# Altium project VC099_V13_20211125.PrjPcb (part 2 of 2)

## Sheet 03.SchDoc
size 386 x 246 mm
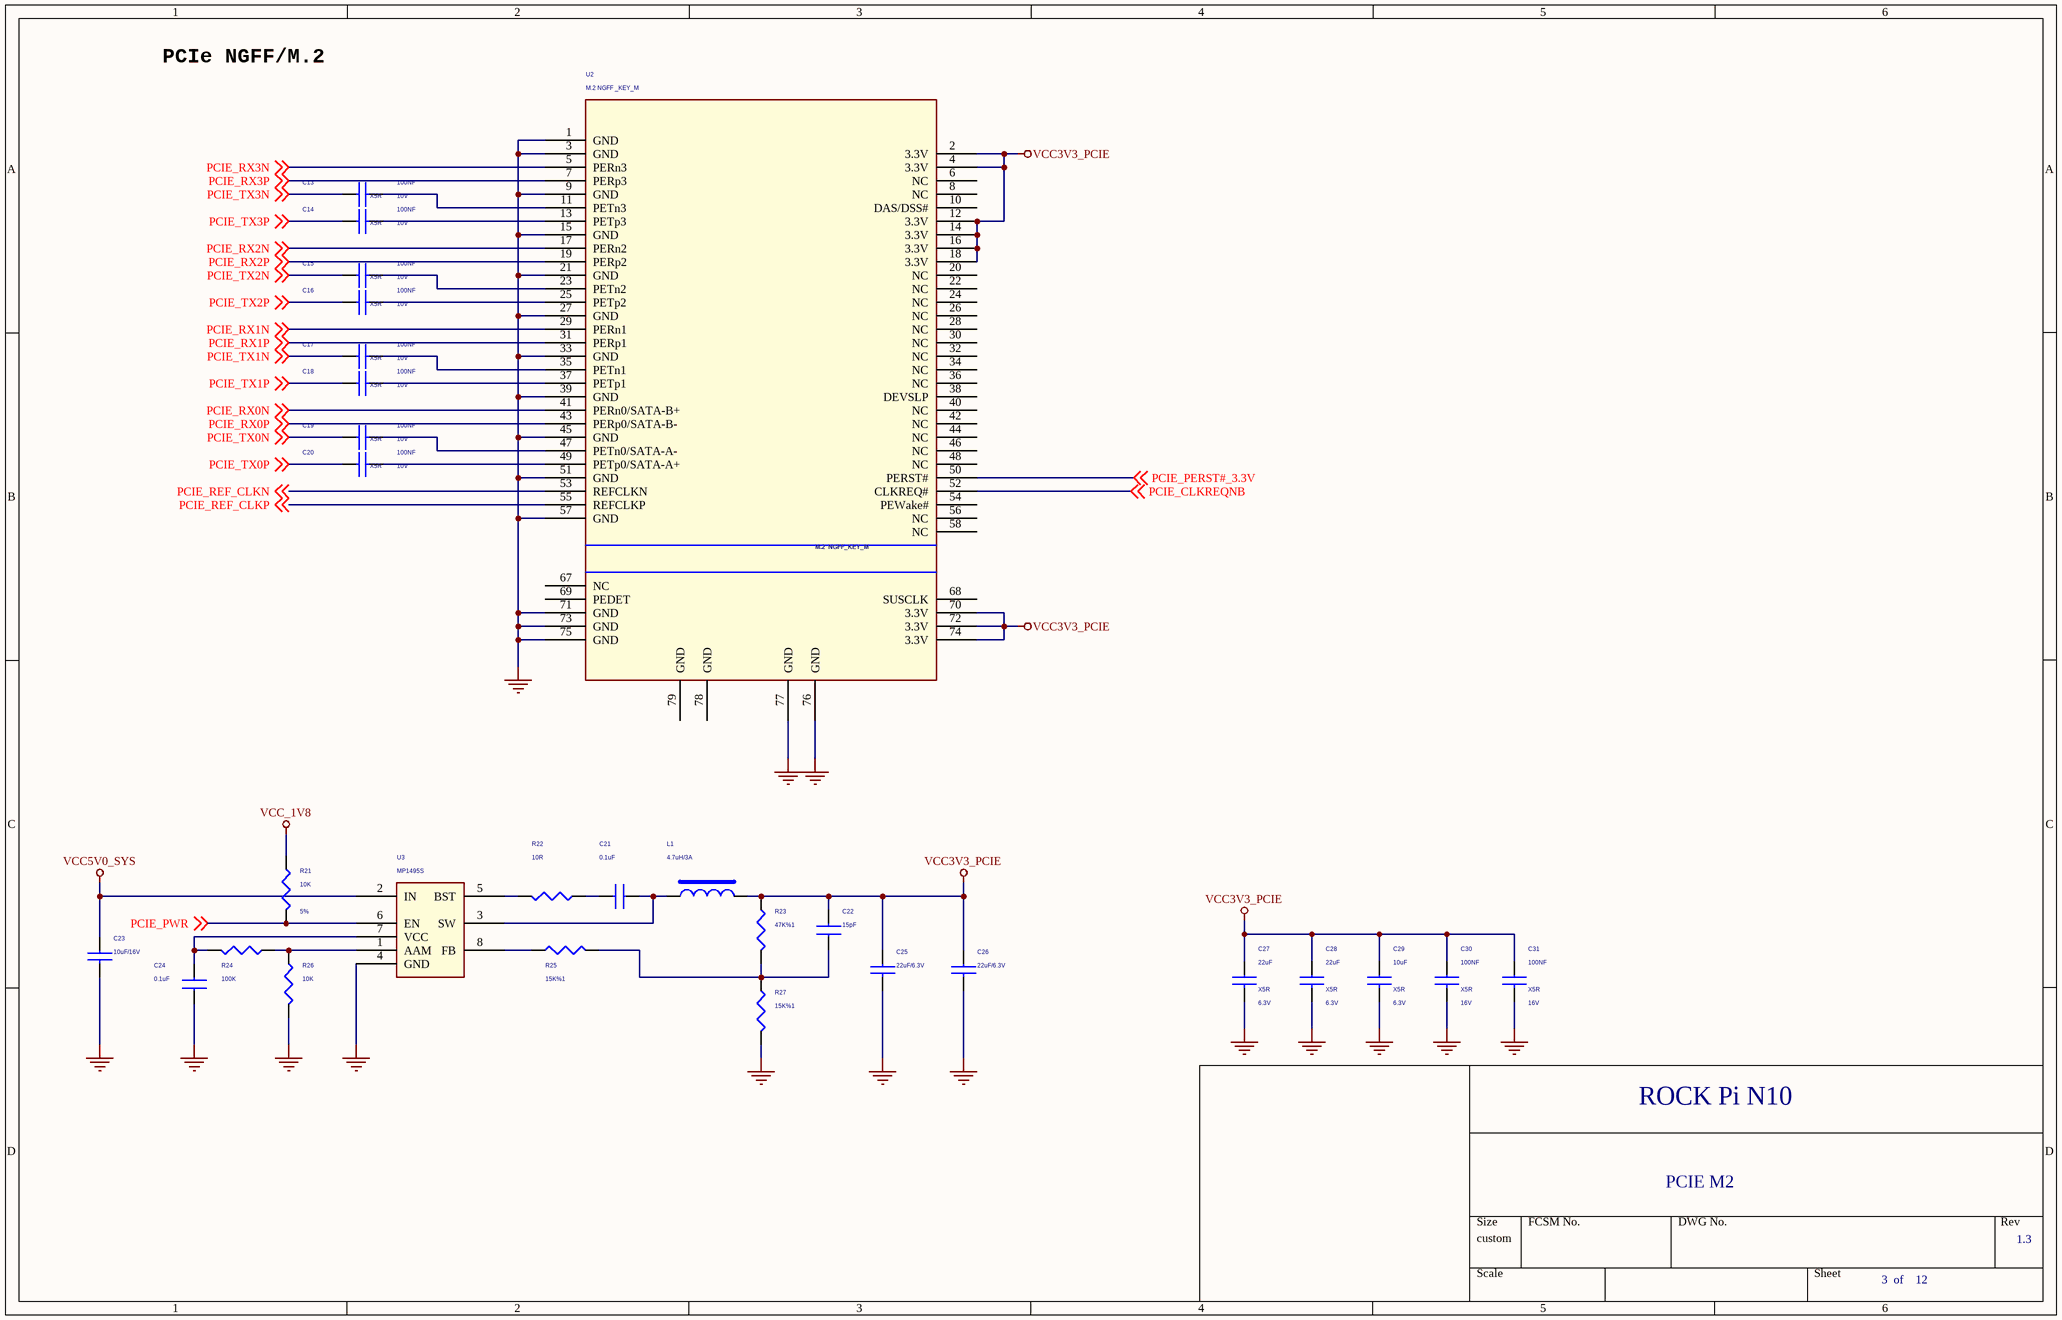
[diagram p9: 03.SchDoc]

### Parts
C13  100NF  Dielectric: X5R  Voltage: 10V  [C0201]
C14  100NF  Dielectric: X5R  Voltage: 10V  [C0201]
C15  100NF  Dielectric: X5R  Voltage: 10V  [C0201]
C16  100NF  Dielectric: X5R  Voltage: 10V  [C0201]
C17  100NF  Dielectric: X5R  Voltage: 10V  [C0201]
C18  100NF  Dielectric: X5R  Voltage: 10V  [C0201]
C19  100NF  Dielectric: X5R  Voltage: 10V  [C0201]
C20  100NF  Dielectric: X5R  Voltage: 10V  [C0201]
C21  0.1uF  [C0603]
C22  15pF  [C0603]
C23  10uF/16V  [C0805]
C24  0.1uF  [C0603]
C25  22uF/6.3V  [C0805]
C26  22uF/6.3V  [C0805]
C27  22uF  Dielectric: X5R  Voltage: 6.3V  [C0805]
C28  22uF  Dielectric: X5R  Voltage: 6.3V  [C0805]
C29  10uF  Dielectric: X5R  Voltage: 6.3V  [C0603]
C30  100NF  Dielectric: X5R  Voltage: 16V  [C0402]
C31  100NF  Dielectric: X5R  Voltage: 16V  [C0402]
L1  4.7uH/3A  [IND-6X6]
R21  10K  Tolerance: 5%  [R0402]
R22  10R  [R0402]
R23  47K%1  [R0402]
R24  100K  [R0402]
R25  15K%1  [R0402]
R26  10K  [R0402]
R27  15K%1  [R0402]
U2  M.2 NGFF _KEY_M  [M2_NGFF_KEY_M]
U3  MP1495S  [TSOT_23_8]

### Nets
GND: C23.2 C24.1 C25.2 C26.2 C27.2 C28.2 C29.2 C30.2 C31.2 R26.2 R27.2 U2.1(GND) U2.3(GND) U2.9(GND) U2.15(GND) U2.21(GND) U2.27(GND) U2.33(GND) U2.39(GND) U2.45(GND) U2.51(GND) U2.57(GND) U2.71(GND) U2.73(GND) U2.75(GND) U2.76(GND) U2.77(GND) U3.4(GND)
VCC3V3_PCIE: C22.2 C25.1 C26.1 C27.1 C28.1 C29.1 C30.1 C31.1 L1.2 R23.1 U2.2(3.3V) U2.4(3.3V) U2.12(3.3V) U2.14(3.3V) U2.16(3.3V) U2.18(3.3V) U2.70(3.3V) U2.72(3.3V) U2.74(3.3V)
VCC5V0_SYS: C23.1 U3.2(IN)
VCC_1V8: R21.1
PCIE_CLKREQNB: U2.52(CLKREQ#) ; off-sheet PCIE_CLKREQNB
PCIE_PERST#_3.3V: U2.50(PERST#) ; off-sheet PCIE_PERST#_3.3V
PCIE_PWR: R21.2 U3.6(EN) ; off-sheet PCIE_PWR
PCIE_REF_CLKN: U2.53(REFCLKN) ; off-sheet PCIE_REF_CLKN
PCIE_REF_CLKP: U2.55(REFCLKP) ; off-sheet PCIE_REF_CLKP
PCIE_RX0N: U2.41(PERn0/SATA-B+) ; off-sheet PCIE_RX0N
PCIE_RX0P: U2.43(PERp0/SATA-B-) ; off-sheet PCIE_RX0P
PCIE_RX1N: U2.29(PERn1) ; off-sheet PCIE_RX1N
PCIE_RX1P: U2.31(PERp1) ; off-sheet PCIE_RX1P
PCIE_RX2N: U2.17(PERn2) ; off-sheet PCIE_RX2N
PCIE_RX2P: U2.19(PERp2) ; off-sheet PCIE_RX2P
PCIE_RX3N: U2.5(PERn3) ; off-sheet PCIE_RX3N
PCIE_RX3P: U2.7(PERp3) ; off-sheet PCIE_RX3P
PCIE_TX0N: C19.1 ; off-sheet PCIE_TX0N
PCIE_TX0P: C20.1 ; off-sheet PCIE_TX0P
PCIE_TX1N: C17.1 ; off-sheet PCIE_TX1N
PCIE_TX1P: C18.1 ; off-sheet PCIE_TX1P
PCIE_TX2N: C15.1 ; off-sheet PCIE_TX2N
PCIE_TX2P: C16.1 ; off-sheet PCIE_TX2P
PCIE_TX3N: C13.1 ; off-sheet PCIE_TX3N
PCIE_TX3P: C14.1 ; off-sheet PCIE_TX3P
NetC13_2: C13.2 U2.11(PETn3)
NetC14_2: C14.2 U2.13(PETp3)
NetC15_2: C15.2 U2.23(PETn2)
NetC16_2: C16.2 U2.25(PETp2)
NetC17_2: C17.2 U2.35(PETn1)
NetC18_2: C18.2 U2.37(PETp1)
NetC19_2: C19.2 U2.47(PETn0/SATA-A-)
NetC20_2: C20.2 U2.49(PETp0/SATA-A+)
NetC21_1: C21.1 L1.1 U3.3(SW)
NetC21_2: C21.2 R22.1
NetC22_1: C22.1 R23.2 R25.2 R27.1
NetC24_2: C24.2 R24.2 U3.7(VCC)
NetR22_2: R22.2 U3.5(BST)
NetR24_1: R24.1 R26.1 U3.1(AAM)
NetR25_1: R25.1 U3.8(FB)

Not connected (* = marked no-connect by the designer): U2 6(NC) 8(NC) 10(DAS/DSS#) 20(NC) 22(NC) 24(NC) 26(NC) 28(NC) 30(NC) 32(NC) 34(NC) 36(NC) 38(DEVSLP) 40(NC) 42(NC) 44(NC) 46(NC) 48(NC) 54(PEWake#) 56(NC) 58(NC) 67(NC) 68(SUSCLK) 69(PEDET) 78(GND) 79(GND)

### Notes on the sheet
- PCIe NGFF/M.2
- ROCK Pi N10
- PCIE M2
- 1.3
- 3  of    12
- (in symbol M_5.2 NGFF EKEY SOCKET) M.2  NGFF_KEY_M

### Library data of the parts
C13-C18 = CAP NP_2: cap,100.00nF,+/-10%,10V,X5R,C0201; Manufacturer PN: C0603X5R1A104K030BC; Manufacturer: TDK; Tolerance: 10%; Priority: A; Created by: JJJ; Part Type: C0201; RK PN: C0603X5R1A104K030BC
C19 C20 = CAP NP_2: cap,100.00nF,+/-10%,10V,X5R,C0201; Manufacturer: TDK; RK PN: C0603X5R1A104K030BC; Priority: A; Tolerance: 10%; Part Type: C0201; Manufacturer PN: C0603X5R1A104K030BC; Created by: JJJ
C21 C22 C24 = CAP NP_Dup3: RoHS CHIP CAP 1uF +10/-10% 16V X5R
C23 C25 C26 = CAP NP_2_Dup1: ROOM: CHG
C27 C28 = CAP NP_2: cap,22.00uF,+/-20%,6.3V,X5R,C0603; Manufacturer PN: C1608X5R0J226M080AC; Manufacturer: TDK; Tolerance: 20%; Priority: A; Created by: JJJ; Part Type: C0603; RK PN: C1608X5R0J226M080AC
C29 = CAP NP_2: cap,10.00uF,+/-10%,6.3V,X5R,C0603; Manufacturer PN: C1608X5R0J106K080AB; Manufacturer: TDK; Tolerance: 10%; Priority: A; Created by: JJJ; Part Type: C0603; RK PN: C1608X5R0J106K080AB
C30 = CAP NP_2: as C108 on sheet 12; Part Type: C0402; Manufacturer PN: C1005X5R1C104K050BA; Created by: JJJ
C31 = CAP NP_2: as C107 on sheet 12; Created by: JJJ; Part Type: C0402; RK PN: C1005X5R1C104K050BA
L1 = INDUCTORS OF FERRITE_Dup1
R21 = RESISTOR_3: as R89 on sheet 11; Created by: YTL; Part Type: 通用厚膜电阻; RK PN: RC0402JR-0710KL
R22-R27 = RESISTOR_0: RES,thick film,47KOhm,+/-5%,1/16W,SMD0402; MARK: 51K
U2 = M_5.2 NGFF EKEY SOCKET
U3 = BUCK-MP1495

## Sheet 02.SchDoc
size 297 x 209 mm
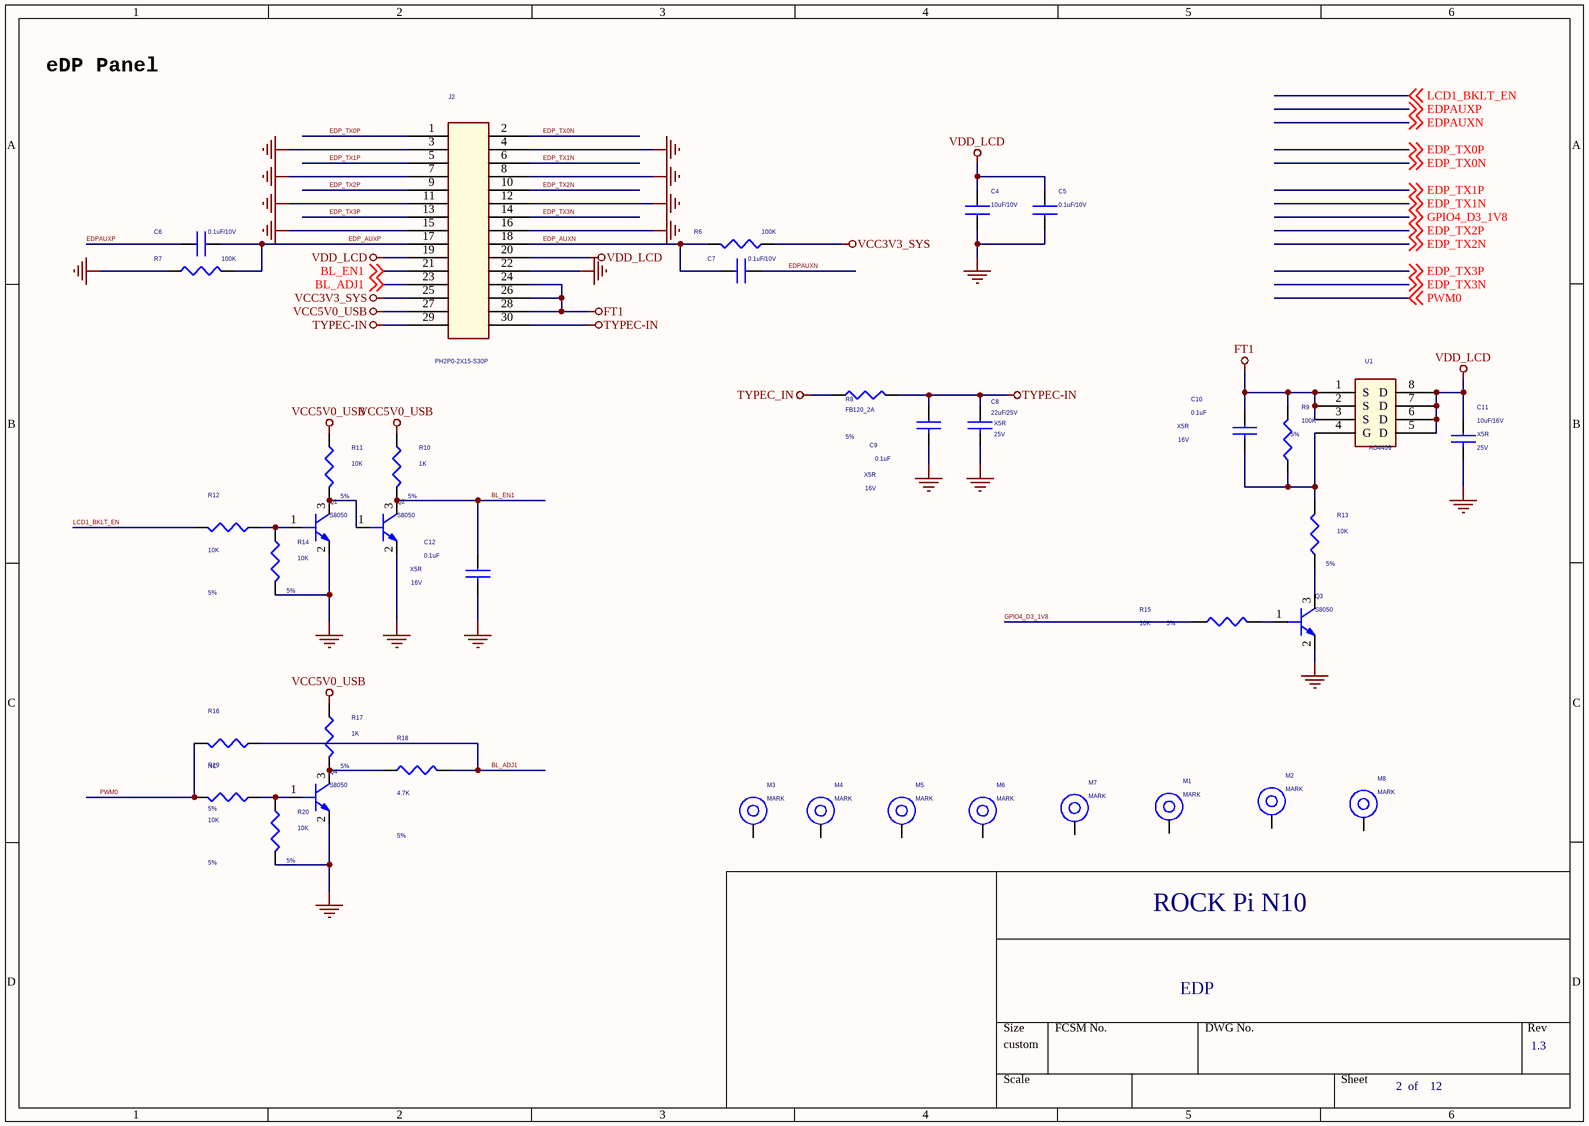
[diagram p10: 02.SchDoc]

### Parts
C4  10uF/10V  [C0603]
C5  0.1uF/10V  [C0603]
C6  0.1uF/10V  [C0603]
C7  0.1uF/10V  [C0603]
C8  22uF/25V  Dielectric: X5R  Voltage: 25V  [C0805]
C9  0.1uF  Dielectric: X5R  Voltage: 16V  [C0402]
C10  0.1uF  Dielectric: X5R  Voltage: 16V  [C0402]
C11  10uF/16V  Dielectric: X5R  Voltage: 25V  [C0805]
C12  0.1uF  Dielectric: X5R  Voltage: 16V  [C0402]
J2  PH2P0-2X15-S30P  [PH2P0-2X15-S30P]
M1  MARK  [MARK]
M2  MARK  [MARK]
M3  MARK  [MARK]
M4  MARK  [MARK]
M5  MARK  [MARK]
M6  MARK  [MARK]
M7  MARK  [MARK]
M8  MARK  [MARK]
Q1  S8050  [SOT_23]
Q2  S8050  [SOT_23]
Q3  S8050  [SOT23]
Q4  S8050  [SOT_23]
R6  100K  [R0402]
R7  100K  [R0402]
R8  FB120_2A  Tolerance: 5%  [R0402]
R9  100K  Tolerance: 5%  [R0402]
R10  1K  Tolerance: 5%  [R0402]
R11  10K  Tolerance: 5%  [R0402]
R12  10K  Tolerance: 5%  [R0402]
R13  10K  Tolerance: 5%  [R0402]
R14  10K  Tolerance: 5%  [R0402]
R15  10K  Tolerance: 5%  [R0402]
R16  NC  Tolerance: 5%  [R0402]
R17  1K  Tolerance: 5%  [R0402]
R18  4.7K  Tolerance: 5%  [R0402]
R19  10K  Tolerance: 5%  [R0402]
R20  10K  Tolerance: 5%  [R0402]
U1  AO4409  [SOP8-50-150]

### Nets
FT1: C10.1 J2.24 J2.26 J2.28 R9.1 U1.1(S) U1.2(S) U1.3(S)
GND: C4.2 C5.2 C8.2 C9.2 C11.2 C12.2 J2.3 J2.4 J2.7 J2.8 J2.11 J2.12 J2.15 J2.16 J2.22 Q1.2(EMITTER) Q2.2(EMITTER) Q3.2(EMITTER) Q4.2(EMITTER) R7.2 R14.1 R20.1
TYPEC-IN: C8.1 C9.1 J2.29 J2.30 R8.2
TYPEC_IN: R8.1
VCC3V3_SYS: J2.25 R6.2
VCC5V0_USB: J2.27 R10.2 R11.2 R17.2
VDD_LCD: C4.1 C5.1 C11.1 J2.19 J2.20 U1.5(D) U1.6(D) U1.7(D) U1.8(D)
BL_ADJ1: J2.23 R16.2 R18.1 ; off-sheet BL_ADJ1
BL_EN1: C12.1 J2.21 Q2.3(COLLECTOR) R10.1 ; off-sheet BL_EN1
EDP_AUXN: C7.2 J2.18 R6.1
EDP_AUXP: C6.2 J2.17 R7.1
EDP_TX0N: J2.2 ; off-sheet EDP_TX0N
EDP_TX0P: J2.1 ; off-sheet EDP_TX0P
EDP_TX1N: J2.6 ; off-sheet EDP_TX1N
EDP_TX1P: J2.5 ; off-sheet EDP_TX1P
EDP_TX2N: J2.10 ; off-sheet EDP_TX2N
EDP_TX2P: J2.9 ; off-sheet EDP_TX2P
EDP_TX3N: J2.14 ; off-sheet EDP_TX3N
EDP_TX3P: J2.13 ; off-sheet EDP_TX3P
EDPAUXN: C7.1 ; off-sheet EDPAUXN
EDPAUXP: C6.1 ; off-sheet EDPAUXP
GPIO4_D3_1V8: R15.1 ; off-sheet GPIO4_D3_1V8
LCD1_BKLT_EN: R12.1 ; off-sheet LCD1_BKLT_EN
PWM0: R16.1 R19.1 ; off-sheet PWM0
NetC10_2: C10.2 R9.2 R13.1 U1.4(G)
NetQ1_1: Q1.1(BASE) R12.2 R14.2
NetQ1_3: Q1.3(COLLECTOR) Q2.1(BASE) R11.1
NetQ3_1: Q3.1(BASE) R15.2
NetQ3_3: Q3.3(COLLECTOR) R13.2
NetQ4_1: Q4.1(BASE) R19.2 R20.2
NetQ4_3: Q4.3(COLLECTOR) R17.1 R18.2

Not connected (* = marked no-connect by the designer): M1 1; M2 1; M3 1; M4 1; M5 1; M6 1; M7 1; M8 1

### Notes on the sheet
- eDP Panel
- ROCK Pi N10
- EDP
- 1.3
- 2  of    12

### Library data of the parts
C4 = CAP NP_Dup4: CAP,MLCC,4.7uF,+/-10%,X5R,6.3V,SMD0603
C5-C7 = CAP NP_Dup4: CAP,MLCC,100nF,+/-10%,X7R,6.3V,SMD0402
C8 = CAP NP_2: cap,4.70uF,+/-10%,6.3V,X5R,C0603; Manufacturer PN: C1608X5R0J475K080AB; Manufacturer: TDK; Tolerance: 10%; Priority: A; Created by: JJJ; Part Type: C0603; RK PN: C1608X5R0J475K080AB
C9 C12 = CAP NP_2: cap,100.00nF,+/-10%,6.3V,X5R,C0402; Manufacturer PN: C1005X5R0J104K050BA; Manufacturer: TDK; Tolerance: 10%; Priority: A; Created by: JJJ; Part Type: C0402; RK PN: C1005X5R0J104K050BA
C10 = CAP NP_2: cap,100.00nF,+/-10%,6.3V,X5R,C0402; Manufacturer: TDK; RK PN: C1005X5R0J104K050BA; Priority: A; Tolerance: 10%; Part Type: C0402; Manufacturer PN: C1005X5R0J104K050BA; Created by: JJJ
C11 = CAP NP_2: cap,4.70uF,+/-10%,6.3V,X5R,C0603; Manufacturer: TDK; RK PN: C1608X5R0J475K080AB; Priority: A; Tolerance: 10%; Part Type: C0603; Manufacturer PN: C1608X5R0J475K080AB; Created by: JJJ
J2 = CON20A_2
M1 M2 M4-M8 = MARK: MARK Symble; RK PN: MARK01; Priority: A; Part Type: MARK; Created by: CZD
M3 = MARK: MARK Symble; Priority: A; RK PN: MARK01; Created by: CZD; Part Type: MARK
Q1 Q2 = NPN: S8050 SOT23; Manufacturer: 长电; Manufacturer PN: S8050_SOT23; Priority: A; Ic: 0.5A; Vceo: 25V; Pc: 0.3W; RK PN: S8050; Part Type: NPN; Created by: JJJ
Q3 Q4 = NPN: S8050 SOT23; Manufacturer PN: S8050_SOT23; Manufacturer: 长电; Pc: 0.3W; Vceo: 25V; Ic: 0.5A; Priority: A; Created by: JJJ; Part Type: NPN; RK PN: S8050
R6 R7 = RESISTOR_1_Dup1
R8 R10 R13 R19 R20 = RESISTOR_3: as R89 on sheet 11; Created by: YTL; RK PN: RC0402JR-0710KL
  R8: Part Type: R0603
  R10 R13 R19 R20: Part Type: 通用厚膜电阻
R9 = RESISTOR_3: 通用厚膜电阻,100K,+/-5%,R0402,1/16W.; Manufacturer: YAGEO; RK PN: RC0402JR-07100KL; Priority: A; Wattage: 1/16W; Part Type: 通用厚膜电阻; Manufacturer PN: RC0402JR-07100KL; Created by: YTL
R11 R12 R14-R18 = RESISTOR_3: 通用厚膜电阻,10K,+/-5%,R0402,1/16W.; Manufacturer: YAGEO; RK PN: RC0402JR-0710KL; Priority: A; Wattage: 1/16W; Part Type: 通用厚膜电阻; Manufacturer PN: RC0402JR-0710KL; Created by: YTL
U1 = AO4409_0

## Sheet 01.SchDoc
size 420 x 496 mm
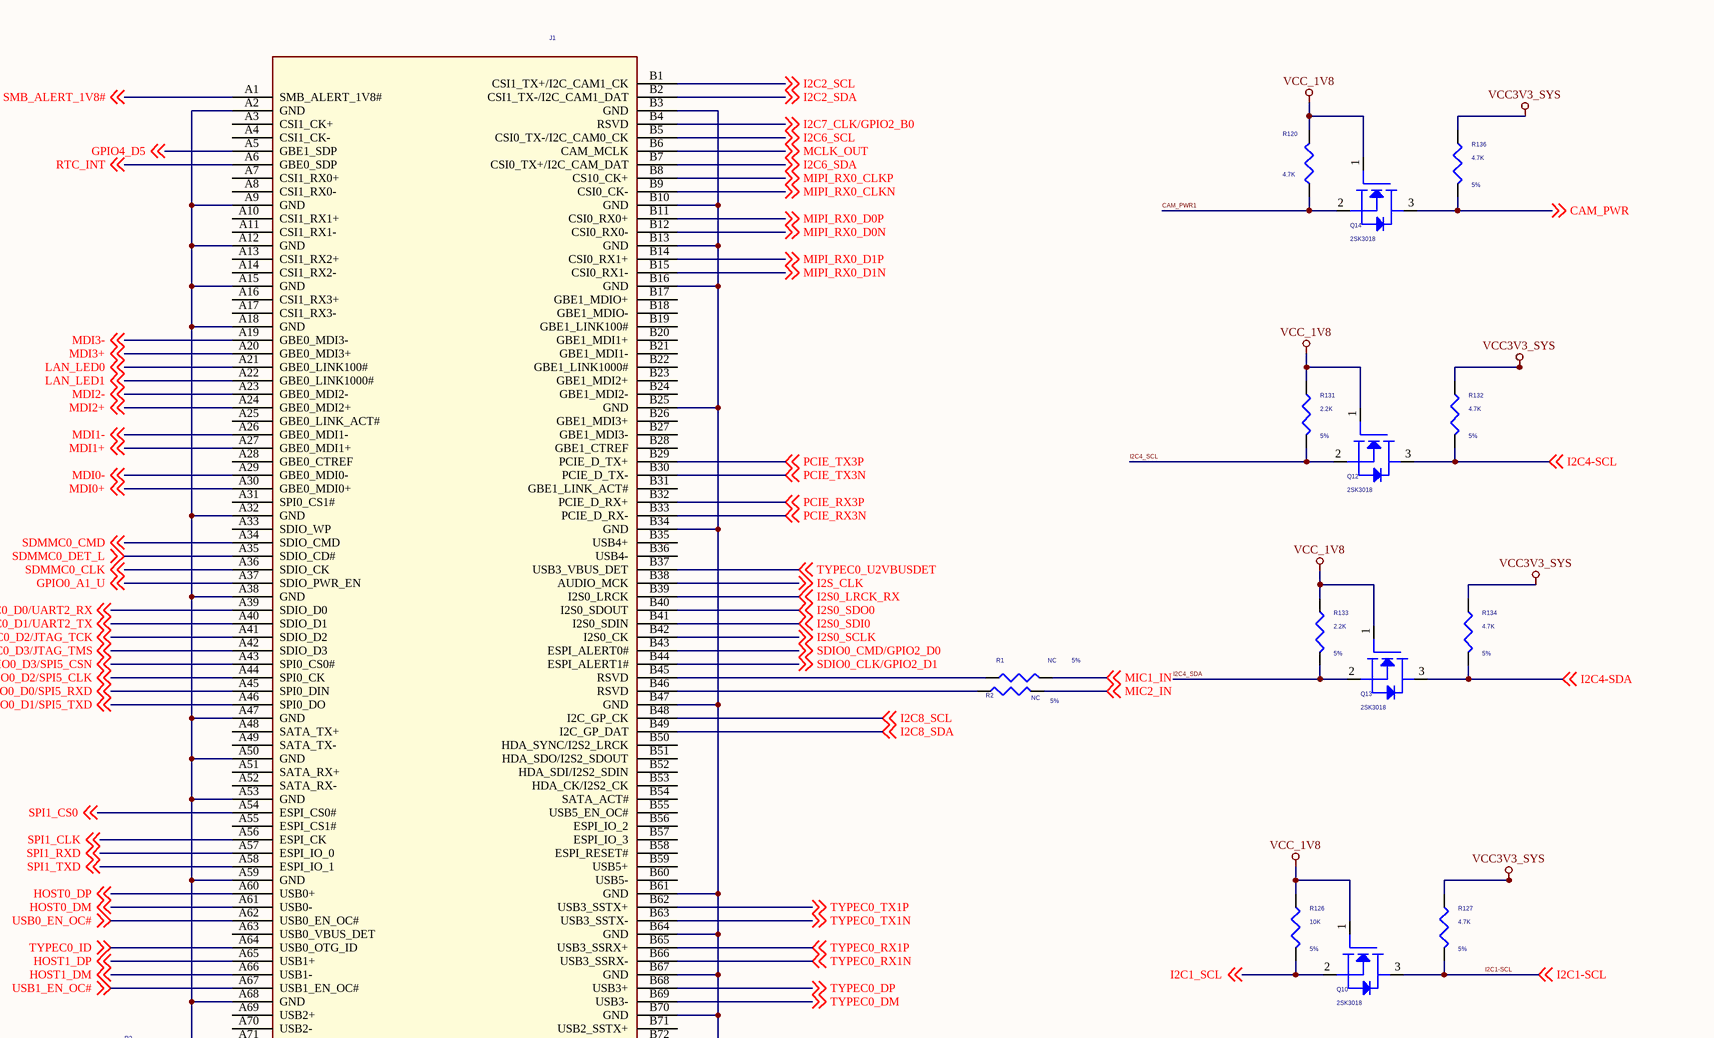
[diagram p11: 01.SchDoc, top]
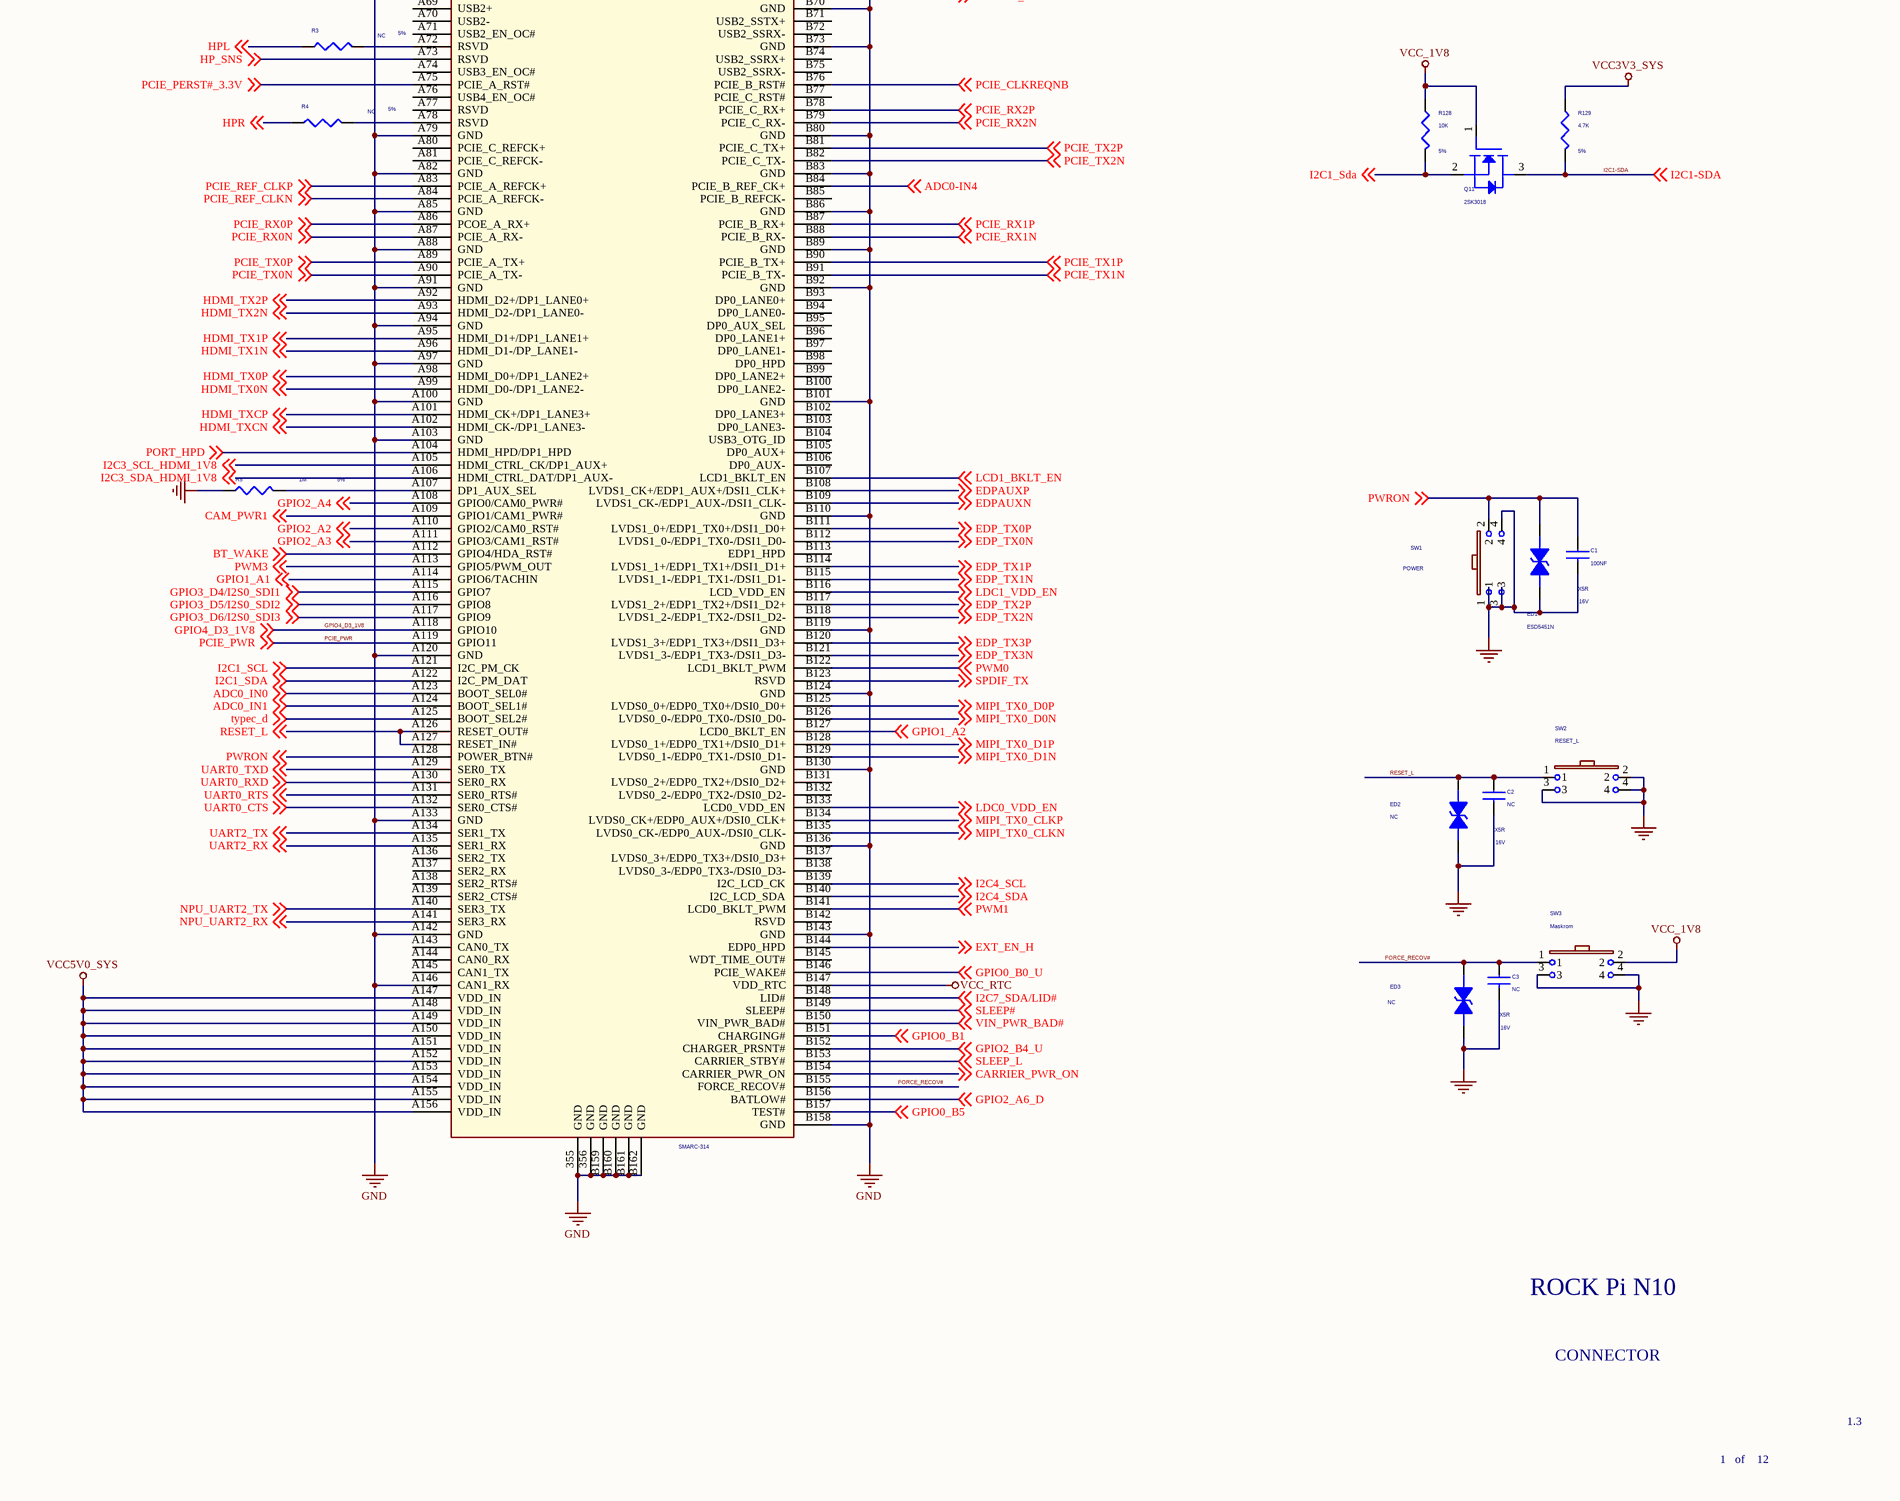
[diagram p12: 01.SchDoc, bottom]

### Parts
C1  100NF  Dielectric: X5R  Voltage: 16V  [C0402]
C2  NC  Dielectric: X5R  Voltage: 16V  [C0402]
C3  NC  Dielectric: X5R  Voltage: 16V  [C0402]
ED1  ESD5451N  [ESD0402]
ED2  NC  [ESD0402]
ED3  NC  [ESD0402]
J1  SMARC-314  [SMARC-314C]
Q10  2SK3018  [SOT23]
Q11  2SK3018  [SOT23]
Q12  2SK3018  [SOT23]
Q13  2SK3018  [SOT23]
Q14  2SK3018  [SOT23]
R1  NC  Tolerance: 5%  [R0402]
R2  NC  Tolerance: 5%  [R0402]
R3  NC  Tolerance: 5%  [R0402]
R4  NC  Tolerance: 5%  [R0402]
R5  1M  Tolerance: 5%  [R0402]
R120  4.7K  [R0402]
R126  10K  Tolerance: 5%  [R0402]
R127  4.7K  Tolerance: 5%  [R0402]
R128  10K  Tolerance: 5%  [R0402]
R129  4.7K  Tolerance: 5%  [R0402]
R131  2.2K  Tolerance: 5%  [R0402]
R132  4.7K  Tolerance: 5%  [R0402]
R133  2.2K  Tolerance: 5%  [R0402]
R134  4.7K  Tolerance: 5%  [R0402]
R136  4.7K  Tolerance: 5%  [R0402]
SW1  POWER  [YC-6615B]
SW2  RESET_L  [YC-6615B]
SW3  Maskrom  [YC-6615B]

### Nets
GND: C1.2 C2.2 C3.2 ED1.2 ED2.2 ED3.2 J1.355(GND) J1.356(GND) J1.A2(GND) J1.A9(GND) J1.A12(GND) J1.A15(GND) J1.A18(GND) J1.A32(GND) J1.A38(GND) J1.A47(GND) J1.A50(GND) J1.A53(GND) J1.A59(GND) J1.A68(GND) J1.A79(GND) J1.A82(GND) J1.A85(GND) J1.A88(GND) J1.A91(GND) J1.A94(GND) J1.A97(GND) J1.A100(GND) J1.A103(GND) J1.A120(GND) J1.A133(GND) J1.A142(GND) J1.A146(CAN1_RX) J1.B3(GND) J1.B10(GND) J1.B13(GND) J1.B16(GND) J1.B25(GND) J1.B34(GND) J1.B47(GND) J1.B61(GND) J1.B64(GND) J1.B67(GND) J1.B70(GND) J1.B73(GND) J1.B80(GND) J1.B83(GND) J1.B86(GND) J1.B89(GND) J1.B92(GND) J1.B101(GND) J1.B110(GND) J1.B119(GND) J1.B124(GND) J1.B130(GND) J1.B136(GND) J1.B143(GND) J1.B158(GND) J1.B159(GND) J1.B160(GND) J1.B161(GND) J1.B162(GND) R5.1 SW1.1 SW1.3 SW1.4 SW2.2 SW2.3 SW2.4 SW3.3 SW3.4
VCC3V3_SYS: R127.1 R129.1 R132.1 R134.1 R136.1
VCC5V0_SYS: J1.A147(VDD_IN) J1.A148(VDD_IN) J1.A149(VDD_IN) J1.A150(VDD_IN) J1.A151(VDD_IN) J1.A152(VDD_IN) J1.A153(VDD_IN) J1.A154(VDD_IN) J1.A155(VDD_IN) J1.A156(VDD_IN)
VCC_1V8: Q10.1(GATE) Q11.1(GATE) Q12.1(GATE) Q13.1(GATE) Q14.1(GATE) R120.2 R126.1 R128.1 R131.1 R133.1 SW3.2
VCC_RTC: J1.B147(VDD_RTC)
ADC0-IN4: J1.B84(PCIE_B_REF_CK+) ; off-sheet ADC0-IN4
ADC0_IN0: J1.A123(BOOT_SEL0#) ; off-sheet ADC0_IN0
ADC0_IN1: J1.A124(BOOT_SEL1#) ; off-sheet ADC0_IN1
BT_WAKE: J1.A112(GPIO4/HDA_RST#) ; off-sheet BT_WAKE
CAM_PWR: Q14.3(DRAIN) R136.2 ; off-sheet CAM_PWR
CAM_PWR1: J1.A109(GPIO1/CAM1_PWR#) Q14.2(SOURCE) R120.1 ; off-sheet CAM_PWR1
CARRIER_PWR_ON: J1.B154(CARRIER_PWR_ON) ; off-sheet CARRIER_PWR_ON
EDP_TX0N: J1.B112(LVDS1_0-/EDP1_TX0-/DSI1_D0-) ; off-sheet EDP_TX0N
EDP_TX0P: J1.B111(LVDS1_0+/EDP1_TX0+/DSI1_D0+) ; off-sheet EDP_TX0P
EDP_TX1N: J1.B115(LVDS1_1-/EDP1_TX1-/DSI1_D1-) ; off-sheet EDP_TX1N
EDP_TX1P: J1.B114(LVDS1_1+/EDP1_TX1+/DSI1_D1+) ; off-sheet EDP_TX1P
EDP_TX2N: J1.B118(LVDS1_2-/EDP1_TX2-/DSI1_D2-) ; off-sheet EDP_TX2N
EDP_TX2P: J1.B117(LVDS1_2+/EDP1_TX2+/DSI1_D2+) ; off-sheet EDP_TX2P
EDP_TX3N: J1.B121(LVDS1_3-/EDP1_TX3-/DSI1_D3-) ; off-sheet EDP_TX3N
EDP_TX3P: J1.B120(LVDS1_3+/EDP1_TX3+/DSI1_D3+) ; off-sheet EDP_TX3P
EDPAUXN: J1.B109(LVDS1_CK-/EDP1_AUX-/DSI1_CLK-) ; off-sheet EDPAUXN
EDPAUXP: J1.B108(LVDS1_CK+/EDP1_AUX+/DSI1_CLK+) ; off-sheet EDPAUXP
EXT_EN_H: J1.B144(EDP0_HPD) ; off-sheet EXT_EN_H
FORCE_RECOV#: C3.1 ED3.1 J1.B155(FORCE_RECOV#) SW3.1
GPIO0_A1_U: J1.A37(SDIO_PWR_EN) ; off-sheet GPIO0_A1_U
GPIO0_B0_U: J1.B146(PCIE_WAKE#) ; off-sheet GPIO0_B0_U
GPIO0_B1: J1.B151(CHARGING#) ; off-sheet GPIO0_B1
GPIO0_B5: J1.B157(TEST#) ; off-sheet GPIO0_B5
GPIO1_A1: J1.A114(GPIO6/TACHIN) ; off-sheet GPIO1_A1
GPIO1_A2: J1.B127(LCD0_BKLT_EN) ; off-sheet GPIO1_A2
GPIO2_A2: J1.A110(GPIO2/CAM0_RST#) ; off-sheet GPIO2_A2
GPIO2_A3: J1.A111(GPIO3/CAM1_RST#) ; off-sheet GPIO2_A3
GPIO2_A4: J1.A108(GPIO0/CAM0_PWR#) ; off-sheet GPIO2_A4
GPIO2_A6_D: J1.B156(BATLOW#) ; off-sheet GPIO2_A6_D
GPIO2_B4_U: J1.B152(CHARGER_PRSNT#) ; off-sheet GPIO2_B4_U
GPIO3_D4/I2S0_SDI1: J1.A115(GPIO7) ; off-sheet GPIO3_D4/I2S0_SDI1
GPIO3_D5/I2S0_SDI2: J1.A116(GPIO8) ; off-sheet GPIO3_D5/I2S0_SDI2
GPIO3_D6/I2S0_SDI3: J1.A117(GPIO9) ; off-sheet GPIO3_D6/I2S0_SDI3
GPIO4_D3_1V8: J1.A118(GPIO10) ; off-sheet GPIO4_D3_1V8
GPIO4_D5: J1.A5(GBE1_SDP) ; off-sheet GPIO4_D5
HDMI_TX0N: J1.A99(HDMI_D0-/DP1_LANE2-) ; off-sheet HDMI_TX0N
HDMI_TX0P: J1.A98(HDMI_D0+/DP1_LANE2+) ; off-sheet HDMI_TX0P
HDMI_TX1N: J1.A96(HDMI_D1-/DP_LANE1-) ; off-sheet HDMI_TX1N
HDMI_TX1P: J1.A95(HDMI_D1+/DP1_LANE1+) ; off-sheet HDMI_TX1P
HDMI_TX2N: J1.A93(HDMI_D2-/DP1_LANE0-) ; off-sheet HDMI_TX2N
HDMI_TX2P: J1.A92(HDMI_D2+/DP1_LANE0+) ; off-sheet HDMI_TX2P
HDMI_TXCN: J1.A102(HDMI_CK-/DP1_LANE3-) ; off-sheet HDMI_TXCN
HDMI_TXCP: J1.A101(HDMI_CK+/DP1_LANE3+) ; off-sheet HDMI_TXCP
HOST0_DM: J1.A61(USB0-) ; off-sheet HOST0_DM
HOST0_DP: J1.A60(USB0+) ; off-sheet HOST0_DP
HOST1_DM: J1.A66(USB1-) ; off-sheet HOST1_DM
HOST1_DP: J1.A65(USB1+) ; off-sheet HOST1_DP
HP_SNS: J1.A73(RSVD) ; off-sheet HP_SNS
HPL: R3.1 ; off-sheet HPL
HPR: R4.1 ; off-sheet HPR
I2C1-SCL: Q10.3(DRAIN) R127.2 ; off-sheet I2C1-SCL
I2C1-SDA: Q11.3(DRAIN) R129.2 ; off-sheet I2C1-SDA
I2C1_SCL: J1.A121(I2C_PM_CK) Q10.2(SOURCE) R126.2 ; off-sheet I2C1_SCL
I2C1_SDA: J1.A122(I2C_PM_DAT) Q11.2(SOURCE) R128.2 ; off-sheet I2C1_SDA, off-sheet I2C1_Sda
I2C2_SCL: J1.B1(CSI1_TX+/I2C_CAM1_CK) ; off-sheet I2C2_SCL
I2C2_SDA: J1.B2(CSI1_TX-/I2C_CAM1_DAT) ; off-sheet I2C2_SDA
I2C3_SCL_HDMI_1V8: J1.A105(HDMI_CTRL_CK/DP1_AUX+) ; off-sheet I2C3_SCL_HDMI_1V8
I2C3_SDA_HDMI_1V8: J1.A106(HDMI_CTRL_DAT/DP1_AUX-) ; off-sheet I2C3_SDA_HDMI_1V8
I2C4-SCL: Q12.3(DRAIN) R132.2 ; off-sheet I2C4-SCL
I2C4-SDA: Q13.3(DRAIN) R134.2 ; off-sheet I2C4-SDA
I2C4_SCL: J1.B139(I2C_LCD_CK) Q12.2(SOURCE) R131.2 ; off-sheet I2C4_SCL
I2C4_SDA: J1.B140(I2C_LCD_SDA) Q13.2(SOURCE) R133.2 ; off-sheet I2C4_SDA
I2C6_SCL: J1.B5(CSI0_TX-/I2C_CAM0_CK) ; off-sheet I2C6_SCL
I2C6_SDA: J1.B7(CSI0_TX+/I2C_CAM_DAT) ; off-sheet I2C6_SDA
I2C7_CLK/GPIO2_B0: J1.B4(RSVD) ; off-sheet I2C7_CLK/GPIO2_B0
I2C7_SDA/LID#: J1.B148(LID#) ; off-sheet I2C7_SDA/LID#
I2C8_SCL: J1.B48(I2C_GP_CK) ; off-sheet I2C8_SCL
I2C8_SDA: J1.B49(I2C_GP_DAT) ; off-sheet I2C8_SDA
I2S0_LRCK_RX: J1.B39(I2S0_LRCK) ; off-sheet I2S0_LRCK_RX
I2S0_SCLK: J1.B42(I2S0_CK) ; off-sheet I2S0_SCLK
I2S0_SDI0: J1.B41(I2S0_SDIN) ; off-sheet I2S0_SDI0
I2S0_SDO0: J1.B40(I2S0_SDOUT) ; off-sheet I2S0_SDO0
I2S_CLK: J1.B38(AUDIO_MCK) ; off-sheet I2S_CLK
LAN_LED0: J1.A21(GBE0_LINK100#) ; off-sheet LAN_LED0
LAN_LED1: J1.A22(GBE0_LINK1000#) ; off-sheet LAN_LED1
LCD1_BKLT_EN: J1.B107(LCD1_BKLT_EN) ; off-sheet LCD1_BKLT_EN
LDC0_VDD_EN: J1.B133(LCD0_VDD_EN) ; off-sheet LDC0_VDD_EN
LDC1_VDD_EN: J1.B116(LCD_VDD_EN) ; off-sheet LDC1_VDD_EN
MCLK_OUT: J1.B6(CAM_MCLK) ; off-sheet MCLK_OUT
MDI0+: J1.A30(GBE0_MDI0+) ; off-sheet MDI0+
MDI0-: J1.A29(GBE0_MDI0-) ; off-sheet MDI0-
MDI1+: J1.A27(GBE0_MDI1+) ; off-sheet MDI1+
MDI1-: J1.A26(GBE0_MDI1-) ; off-sheet MDI1-
MDI2+: J1.A24(GBE0_MDI2+) ; off-sheet MDI2+
MDI2-: J1.A23(GBE0_MDI2-) ; off-sheet MDI2-
MDI3+: J1.A20(GBE0_MDI3+) ; off-sheet MDI3+
MDI3-: J1.A19(GBE0_MDI3-) ; off-sheet MDI3-
MIC1_IN: R1.2 ; off-sheet MIC1_IN
MIC2_IN: R2.2 ; off-sheet MIC2_IN
MIPI_RX0_CLKN: J1.B9(CSI0_CK-) ; off-sheet MIPI_RX0_CLKN
MIPI_RX0_CLKP: J1.B8(CS10_CK+) ; off-sheet MIPI_RX0_CLKP
MIPI_RX0_D0N: J1.B12(CSI0_RX0-) ; off-sheet MIPI_RX0_D0N
MIPI_RX0_D0P: J1.B11(CSI0_RX0+) ; off-sheet MIPI_RX0_D0P
MIPI_RX0_D1N: J1.B15(CSI0_RX1-) ; off-sheet MIPI_RX0_D1N
MIPI_RX0_D1P: J1.B14(CSI0_RX1+) ; off-sheet MIPI_RX0_D1P
MIPI_TX0_CLKN: J1.B135(LVDS0_CK-/EDP0_AUX-/DSI0_CLK-) ; off-sheet MIPI_TX0_CLKN
MIPI_TX0_CLKP: J1.B134(LVDS0_CK+/EDP0_AUX+/DSI0_CLK+) ; off-sheet MIPI_TX0_CLKP
MIPI_TX0_D0N: J1.B126(LVDS0_0-/EDP0_TX0-/DSI0_D0-) ; off-sheet MIPI_TX0_D0N
MIPI_TX0_D0P: J1.B125(LVDS0_0+/EDP0_TX0+/DSI0_D0+) ; off-sheet MIPI_TX0_D0P
MIPI_TX0_D1N: J1.B129(LVDS0_1-/EDP0_TX1-/DSI0_D1-) ; off-sheet MIPI_TX0_D1N
MIPI_TX0_D1P: J1.B128(LVDS0_1+/EDP0_TX1+/DSI0_D1+) ; off-sheet MIPI_TX0_D1P
NPU_UART2_RX: J1.A141(SER3_RX) ; off-sheet NPU_UART2_RX
NPU_UART2_TX: J1.A140(SER3_TX) ; off-sheet NPU_UART2_TX
PCIE_CLKREQNB: J1.B76(PCIE_B_RST#) ; off-sheet PCIE_CLKREQNB
PCIE_PERST#_3.3V: J1.A75(PCIE_A_RST#) ; off-sheet PCIE_PERST#_3.3V
PCIE_PWR: J1.A119(GPIO11) ; off-sheet PCIE_PWR
PCIE_REF_CLKN: J1.A84(PCIE_A_REFCK-) ; off-sheet PCIE_REF_CLKN
PCIE_REF_CLKP: J1.A83(PCIE_A_REFCK+) ; off-sheet PCIE_REF_CLKP
PCIE_RX0N: J1.A87(PCIE_A_RX-) ; off-sheet PCIE_RX0N
PCIE_RX0P: J1.A86(PCOE_A_RX+) ; off-sheet PCIE_RX0P
PCIE_RX1N: J1.B88(PCIE_B_RX-) ; off-sheet PCIE_RX1N
PCIE_RX1P: J1.B87(PCIE_B_RX+) ; off-sheet PCIE_RX1P
PCIE_RX2N: J1.B79(PCIE_C_RX-) ; off-sheet PCIE_RX2N
PCIE_RX2P: J1.B78(PCIE_C_RX+) ; off-sheet PCIE_RX2P
PCIE_RX3N: J1.B33(PCIE_D_RX-) ; off-sheet PCIE_RX3N
PCIE_RX3P: J1.B32(PCIE_D_RX+) ; off-sheet PCIE_RX3P
PCIE_TX0N: J1.A90(PCIE_A_TX-) ; off-sheet PCIE_TX0N
PCIE_TX0P: J1.A89(PCIE_A_TX+) ; off-sheet PCIE_TX0P
PCIE_TX1N: J1.B91(PCIE_B_TX-) ; off-sheet PCIE_TX1N
PCIE_TX1P: J1.B90(PCIE_B_TX+) ; off-sheet PCIE_TX1P
PCIE_TX2N: J1.B82(PCIE_C_TX-) ; off-sheet PCIE_TX2N
PCIE_TX2P: J1.B81(PCIE_C_TX+) ; off-sheet PCIE_TX2P
PCIE_TX3N: J1.B30(PCIE_D_TX-) ; off-sheet PCIE_TX3N
PCIE_TX3P: J1.B29(PCIE_D_TX+) ; off-sheet PCIE_TX3P
PORT_HPD: J1.A104(HDMI_HPD/DP1_HPD) ; off-sheet PORT_HPD
PWM0: J1.B122(LCD1_BKLT_PWM) ; off-sheet PWM0
PWM1: J1.B141(LCD0_BKLT_PWM) ; off-sheet PWM1
PWM3: J1.A113(GPIO5/PWM_OUT) ; off-sheet PWM3
PWRON: C1.1 ED1.1 J1.A128(POWER_BTN#) SW1.2 ; off-sheet PWRON
RESET_L: C2.1 ED2.1 J1.A126(RESET_OUT#) J1.A127(RESET_IN#) SW2.1 ; off-sheet RESET_L
RTC_INT: J1.A6(GBE0_SDP) ; off-sheet RTC_INT
SDIO0_CLK/GPIO2_D1: J1.B44(ESPI_ALERT1#) ; off-sheet SDIO0_CLK/GPIO2_D1
SDIO0_CMD/GPIO2_D0: J1.B43(ESPI_ALERT0#) ; off-sheet SDIO0_CMD/GPIO2_D0
SDIO0_D0/SPI5_RXD: J1.A45(SPI0_DIN) ; off-sheet SDIO0_D0/SPI5_RXD
SDIO0_D1/SPI5_TXD: J1.A46(SPI0_DO) ; off-sheet SDIO0_D1/SPI5_TXD
SDIO0_D2/SPI5_CLK: J1.A44(SPI0_CK) ; off-sheet SDIO0_D2/SPI5_CLK
SDIO0_D3/SPI5_CSN: J1.A43(SPI0_CS0#) ; off-sheet SDIO0_D3/SPI5_CSN
SDMMC0_CLK: J1.A36(SDIO_CK) ; off-sheet SDMMC0_CLK
SDMMC0_CMD: J1.A34(SDIO_CMD) ; off-sheet SDMMC0_CMD
SDMMC0_D0/UART2_RX: J1.A39(SDIO_D0) ; off-sheet SDMMC0_D0/UART2_RX
SDMMC0_D1/UART2_TX: J1.A40(SDIO_D1) ; off-sheet SDMMC0_D1/UART2_TX
SDMMC0_D2/JTAG_TCK: J1.A41(SDIO_D2) ; off-sheet SDMMC0_D2/JTAG_TCK
SDMMC0_D3/JTAG_TMS: J1.A42(SDIO_D3) ; off-sheet SDMMC0_D3/JTAG_TMS
SDMMC0_DET_L: J1.A35(SDIO_CD#) ; off-sheet SDMMC0_DET_L
SLEEP#: J1.B149(SLEEP#) ; off-sheet SLEEP#
SLEEP_L: J1.B153(CARRIER_STBY#) ; off-sheet SLEEP_L
SMB_ALERT_1V8#: J1.A1(SMB_ALERT_1V8#) ; off-sheet SMB_ALERT_1V8#
SPDIF_TX: J1.B123(RSVD) ; off-sheet SPDIF_TX
SPI1_CLK: J1.A56(ESPI_CK) ; off-sheet SPI1_CLK
SPI1_CS0: J1.A54(ESPI_CS0#) ; off-sheet SPI1_CS0
SPI1_RXD: J1.A57(ESPI_IO_0) ; off-sheet SPI1_RXD
SPI1_TXD: J1.A58(ESPI_IO_1) ; off-sheet SPI1_TXD
TYPEC0_DM: J1.B69(USB3-) ; off-sheet TYPEC0_DM
TYPEC0_DP: J1.B68(USB3+) ; off-sheet TYPEC0_DP
TYPEC0_ID: J1.A64(USB0_OTG_ID) ; off-sheet TYPEC0_ID
TYPEC0_RX1N: J1.B66(USB3_SSRX-) ; off-sheet TYPEC0_RX1N
TYPEC0_RX1P: J1.B65(USB3_SSRX+) ; off-sheet TYPEC0_RX1P
TYPEC0_TX1N: J1.B63(USB3_SSTX-) ; off-sheet TYPEC0_TX1N
TYPEC0_TX1P: J1.B62(USB3_SSTX+) ; off-sheet TYPEC0_TX1P
TYPEC0_U2VBUSDET: J1.B37(USB3_VBUS_DET) ; off-sheet TYPEC0_U2VBUSDET
TYPEC_D: J1.A125(BOOT_SEL2#) ; off-sheet typec_d
UART0_CTS: J1.A132(SER0_CTS#) ; off-sheet UART0_CTS
UART0_RTS: J1.A131(SER0_RTS#) ; off-sheet UART0_RTS
UART0_RXD: J1.A130(SER0_RX) ; off-sheet UART0_RXD
UART0_TXD: J1.A129(SER0_TX) ; off-sheet UART0_TXD
UART2_RX: J1.A135(SER1_RX) ; off-sheet UART2_RX
UART2_TX: J1.A134(SER1_TX) ; off-sheet UART2_TX
USB0_EN_OC#: J1.A62(USB0_EN_OC#) ; off-sheet USB0_EN_OC#
USB1_EN_OC#: J1.A67(USB1_EN_OC#) ; off-sheet USB1_EN_OC#
VIN_PWR_BAD#: J1.B150(VIN_PWR_BAD#) ; off-sheet VIN_PWR_BAD#
NetJ1_A72: J1.A72(RSVD) R3.2
NetJ1_A78: J1.A78(RSVD) R4.2
NetJ1_A107: J1.A107(DP1_AUX_SEL) R5.2
NetJ1_B45: J1.B45(RSVD) R1.1
NetJ1_B46: J1.B46(RSVD) R2.1

Not connected (* = marked no-connect by the designer): J1 A3(CSI1_CK+) A4(CSI1_CK-) A7(CSI1_RX0+) A8(CSI1_RX0-) A10(CSI1_RX1+) A11(CSI1_RX1-) A13(CSI1_RX2+) A14(CSI1_RX2-) A16(CSI1_RX3+) A17(CSI1_RX3-) A25(GBE0_LINK_ACT#) A28(GBE0_CTREF) A31(SPI0_CS1#) A33(SDIO_WP) A48(SATA_TX+) A49(SATA_TX-) A51(SATA_RX+) A52(SATA_RX-) A55(ESPI_CS1#) A63(USB0_VBUS_DET) A69(USB2+) A70(USB2-) A71(USB2_EN_OC#) A74(USB3_EN_OC#) A76(USB4_EN_OC#) A77(RSVD) A80(PCIE_C_REFCK+) A81(PCIE_C_REFCK-) A136(SER2_TX) A137(SER2_RX) A138(SER2_RTS#) A139(SER2_CTS#) A143(CAN0_TX) A144(CAN0_RX) A145(CAN1_TX) B17(GBE1_MDIO+) B18(GBE1_MDIO-) B19(GBE1_LINK100#) B20(GBE1_MDI1+) B21(GBE1_MDI1-) B22(GBE1_LINK1000#) B23(GBE1_MDI2+) B24(GBE1_MDI2-) B26(GBE1_MDI3+) B27(GBE1_MDI3-) B28(GBE1_CTREF) B31(GBE1_LINK_ACT#) B35(USB4+) B36(USB4-) B50(HDA_SYNC/I2S2_LRCK) B51(HDA_SDO/I2S2_SDOUT) B52(HDA_SDI/I2S2_SDIN) B53(HDA_CK/I2S2_CK) B54(SATA_ACT#) B55(USB5_EN_OC#) B56(ESPI_IO_2) B57(ESPI_IO_3) B58(ESPI_RESET#) B59(USB5+) B60(USB5-) B71(USB2_SSTX+) B72(USB2_SSRX-) B74(USB2_SSRX+) B75(USB2_SSRX-) B77(PCIE_C_RST#) B85(PCIE_B_REFCK-) B93(DP0_LANE0+) B94(DP0_LANE0-) B95(DP0_AUX_SEL) B96(DP0_LANE1+) B97(DP0_LANE1-) B98(DP0_HPD) B99(DP0_LANE2+) B100(DP0_LANE2-) B102(DP0_LANE3+) B103(DP0_LANE3-) B104(USB3_OTG_ID) B105(DP0_AUX+) B106(DP0_AUX-) B113(EDP1_HPD) B131(LVDS0_2+/EDP0_TX2+/DSI0_D2+) B132(LVDS0_2-/EDP0_TX2-/DSI0_D2-) B137(LVDS0_3+/EDP0_TX3+/DSI0_D3+) B138(LVDS0_3-/EDP0_TX3-/DSI0_D3-) B142(RSVD) B145(WDT_TIME_OUT#)

### Notes on the sheet
- ROCK Pi N10
- CONNECTOR
- 1.3
- 1   of    12

### Library data of the parts
C1 = CAP NP_2: cap,100.00nF,+/-10%,16V,X5R,C0402; Manufacturer: TDK; RK PN: C1005X5R1C104K050BA; Priority: A; Tolerance: 10%; Part Type: C0402; Manufacturer PN: C1005X5R1C104K050BA; Created by: JJJ
C2 C3 = CAP NP_2: cap,100.00nF,+/-10%,16V,X5R,C0402; Manufacturer PN: C1005X5R1C104K050BA; Manufacturer: TDK; Tolerance: 10%; Priority: A; Created by: JJJ; Part Type: C0402; RK PN: C1005X5R1C104K050BA
ED1 = DIODE BI_DIR TRIG_0: 1-Line, Bi-directional, Transient Voltage Suppressors.17.5pF.; Manufacturer: WillSemi(韦尔半导体); Priority: A; RK PN: ESD5451N; Part Type: ESD_TVS; Manufacturer PN: ESD5451N; Created by: JJJ
ED2 = DIODE BI_DIR TRIG_0: 1-Line, Bi-directional, Transient Voltage Suppressors.17.5pF.; Manufacturer: WillSemi(韦尔半导体); RK PN: ESD5451N; Priority: A; Part Type: ESD_TVS; Manufacturer PN: ESD5451N; Created by: JJJ
ED3 = DIODE BI_DIR TRIG_0: 1-Line, Bi-directional, Transient Voltage Suppressors.17.5pF.; Manufacturer PN: ESD5451N; Manufacturer: WillSemi(韦尔半导体); Priority: A; Created by: JJJ; Part Type: ESD_TVS; RK PN: ESD5451N
J1 = SMARC-314_3
Q10-Q13 = MOSFET N: NMOS,2SK3018,SOT_323,Id=0.1A,Vds=30V; Manufacturer: ROHM; Rds: 5ohm; Priority: A; Id_max: 0.1A; Vgs: 20V; VDS: 30V; Vgsth: 1.5V; Pd: 0.2W; RK PN: 2SK3018; Part Type: NMOS; Manufacturer PN: 2SK3018; Created by: JJJ
Q14 = MOSFET N: NMOS,2SK3018,SOT_323,Id=0.1A,Vds=30V; Manufacturer: ROHM; Pd: 0.2W; Vgsth: 1.5V; VDS: 30V; Vgs: 20V; Id_max: 0.1A; Priority: A; Rds: 5ohm; Created by: JJJ; Manufacturer PN: 2SK3018; Part Type: NMOS; RK PN: 2SK3018
R1 R4 R5 = RESISTOR_3: 通用厚膜电阻,22R,+/-5%,R0402,1/16W.; Manufacturer PN: RC0402JR-0722RL; Manufacturer: YAGEO; Wattage: 1/16W; Priority: A; Created by: YTL; Part Type: 通用厚膜电阻; RK PN: RC0402JR-0722RL
R2 R3 = RESISTOR_3: 通用厚膜电阻,22R,+/-5%,R0402,1/16W.; Manufacturer: YAGEO; RK PN: RC0402JR-0722RL; Priority: A; Wattage: 1/16W; Part Type: 通用厚膜电阻; Manufacturer PN: RC0402JR-0722RL; Created by: YTL
R120 = R_2: SMD  0402  4.7K  1/16W  ±5%  ROHS
R126 R128 R131 R133 = RESISTOR_3: 通用厚膜电阻,10K,+/-5%,R0402,1/16W.; Manufacturer PN: RC0402JR-0710KL; Manufacturer: YAGEO; Wattage: 1/16W; Priority: A; Created by: YTL; Part Type: 通用厚膜电阻; RK PN: RC0402JR-0710KL
R127 R129 R132 R134 R136 = RESISTOR_3: 通用厚膜电阻,4.7K,+/-5%,R0402,1/16W.; Manufacturer PN: RC0402JR-071K5L; Manufacturer: YAGEO; Wattage: 1/16W; Priority: A; Created by: YTL; Part Type: 通用厚膜电阻; RK PN: RC0402JR-071K5L
SW1-SW3 = KEY_4PIN: 按键，5mm*5mm，直按，插焊; Manufacturer Part Number: KEY_5X5; Manufacturer: 旺科达; Priority: A; Created by: JJJ; Part Type: KEY; RK PN: KEY_5X5

## Nets that join several sheets
GND: 12 (34 pins), 11 (33 pins), 10 (19 pins), 09 (33 pins), 08 (47 pins), 07 (31 pins), 06 (16 pins), 05 (16 pins), 04 (17 pins), 03 (28 pins), 02 (22 pins), 01 (71 pins)
TYPEC_IN: 12 (C104.1 R102.1 R103.2 U22.1), 11 (D3.1 U19.3), 02 (R8.1)
VCC3V3_SYS: 11 (6 pins), 10 (C83.2 C84.1 CN14.4 R78.2), 08 (10 pins), 06 (R90556.2), 05 (R37.1), 04 (R32.1), 02 (J2.25 R6.2), 01 (5 pins)
VCC5V0_SYS: 12 (6 pins), 11 (10 pins), 08 (C51.1 CON1.2 CON1.4 R62.1), 07 (U9.5 U10.5), 03 (C23.1 U3.2), 01 (10 pins)
VCC5V0_USB: 11 (C94.1 Q8.3 R93.1 U18.1), 09 (6 pins), 08 (R61.1 R130.1), 04 (D1.1 Q7.1), 02 (J2.27 R10.2 R11.2 R17.2)
VCC_1V8: 11 (C95.1 R97.2 U18.5), 10 (C85.1 R81.2), 09 (R123.1), 08 (22 pins), 06 (R47.1), 05 (R33.2 R34.2), 04 (Q5.1 Q6.1 R28.1 R30.1), 03 (R21.1), 01 (11 pins)
VCC_MICBIAS: 09 (C63.1 R74.1 U13.26), 06 (C38.1 R41.2)
VCC_RTC: 11 (C99.1 D4.2 D5.2 U21.8), 01 (J1.B147)
ADC0_IN0: 06 (C39.1 R42.1 R44.2), 01 (J1.A123)
ADC0_IN1: 08 (CON1.26 ED28.1), 01 (J1.A124)
BT_WAKE: 05 (U7.70), 01 (J1.A112)
CAM_PWR: 08 (J9.5), 01 (Q14.3 R136.2)
CARRIER_PWR_ON: 11 (R90557.2), 01 (J1.B154)
EDP_TX0N: 02 (J2.2), 01 (J1.B112)
EDP_TX0P: 02 (J2.1), 01 (J1.B111)
EDP_TX1N: 02 (J2.6), 01 (J1.B115)
EDP_TX1P: 02 (J2.5), 01 (J1.B114)
EDP_TX2N: 02 (J2.10), 01 (J1.B118)
EDP_TX2P: 02 (J2.9), 01 (J1.B117)
EDP_TX3N: 02 (J2.14), 01 (J1.B121)
EDP_TX3P: 02 (J2.13), 01 (J1.B120)
EDPAUXN: 02 (C7.1), 01 (J1.B109)
EDPAUXP: 02 (C6.1), 01 (J1.B108)
EXT_EN_H: 11 (R84.2 R95.2 R96.2 R98.1), 01 (J1.B144)
GPIO0_A1_U: 05 (U7.6), 01 (J1.A37)
GPIO0_B0_U: 08 (U90054.D3), 01 (J1.B146)
GPIO0_B1: 08 (U90056.B3), 01 (J1.B151)
GPIO0_B5: 08 (U90056.C3), 01 (J1.B157)
GPIO1_A1: 11 (R92.1), 01 (J1.A114)
GPIO1_A2: 08 (U90056.A3), 01 (J1.B127)
GPIO2_A2: 08 (U90053.C3), 01 (J1.A110)
GPIO2_A3: 08 (U90053.A3), 01 (J1.A111)
GPIO2_A4: 08 (U90054.C3), 01 (J1.A108)
GPIO2_A6_D: 08 (U90054.B3), 01 (J1.B156)
GPIO2_B4_U: 06 (C42.1 R46.2 R47.2), 01 (J1.B152)
GPIO3_D4/I2S0_SDI1: 08 (U90054.A3), 01 (J1.A115)
GPIO3_D5/I2S0_SDI2: 08 (U90053.D3), 01 (J1.A116)
GPIO3_D6/I2S0_SDI3: 08 (U90053.B3), 01 (J1.A117)
GPIO4_D3_1V8: 02 (R15.1), 01 (J1.A118)
GPIO4_D5: 08 (CON1.33 ED25.1), 01 (J1.A5)
HDMI_TX0N: 04 (J3.9 U6.2 U6.9), 01 (J1.A99)
HDMI_TX0P: 04 (J3.7 U6.1 U6.10), 01 (J1.A98)
HDMI_TX1N: 04 (J3.6 U5.5 U5.6), 01 (J1.A96)
HDMI_TX1P: 04 (J3.4 U5.4 U5.7), 01 (J1.A95)
HDMI_TX2N: 04 (J3.3 U5.2 U5.9), 01 (J1.A93)
HDMI_TX2P: 04 (J3.1 U5.1 U5.10), 01 (J1.A92)
HDMI_TXCN: 04 (J3.12 U6.5 U6.6), 01 (J1.A102)
HDMI_TXCP: 04 (J3.10 U6.4 U6.7), 01 (J1.A101)
HOST0_DM: 07 (ED11.1 J6.2), 01 (J1.A61)
HOST0_DP: 07 (ED10.1 J6.3), 01 (J1.A60)
HOST1_DM: 07 (ED13.1 J6.6), 01 (J1.A66)
HOST1_DP: 07 (ED12.1 J6.7), 01 (J1.A65)
HP_SNS: 06 (AV1.2 R40.2), 01 (J1.A73)
HPL: 09 (R71.1), 06 (C40.1 R45.2), 01 (R3.1)
HPR: 09 (R72.1), 06 (C41.1 R43.2), 01 (R4.1)
I2C1-SCL: 08 (J10.5), 01 (Q10.3 R127.2)
I2C1-SDA: 08 (J10.4), 01 (Q11.3 R129.2)
I2C2_SCL: 11 (R99.2), 08 (U90051.C3), 01 (J1.B1)
I2C2_SDA: 11 (R100.2), 08 (U90051.D3), 01 (J1.B2)
I2C3_SCL_HDMI_1V8: 04 (Q5.2 R28.2), 01 (J1.A105)
I2C3_SDA_HDMI_1V8: 04 (Q6.2 R30.2), 01 (J1.A106)
I2C4-SCL: 08 (J9.3), 01 (Q12.3 R132.2)
I2C4-SDA: 08 (J9.2), 01 (Q13.3 R134.2)
I2C4_SCL: 09 (U13.1), 01 (J1.B139 Q12.2 R131.2)
I2C4_SDA: 09 (U13.32), 01 (J1.B140 Q13.2 R133.2)
I2C6_SCL: 08 (R59.1 U90051.B3), 01 (J1.B5)
I2C6_SDA: 08 (R60.1 U90051.A3), 01 (J1.B7)
I2C7_CLK/GPIO2_B0: 08 (R57.1 U90055.A3), 01 (J1.B4)
I2C7_SDA/LID#: 08 (R58.1 U90055.B3), 01 (J1.B148)
I2C8_SCL: 05 (R33.1 R35.2 U7.60), 01 (J1.B48)
I2C8_SDA: 05 (R34.1 R36.2 U7.58), 01 (J1.B49)
I2S0_LRCK_RX: 09 (U13.8), 01 (J1.B39)
I2S0_SCLK: 09 (U13.6), 01 (J1.B42)
I2S0_SDI0: 09 (U13.9), 01 (J1.B41)
I2S0_SDO0: 09 (U13.7), 01 (J1.B40)
I2S_CLK: 09 (U13.2), 01 (J1.B38)
LAN_LED0: 06 (R90547.2 R90555.2), 01 (J1.A21)
LAN_LED1: 06 (R90544.2), 01 (J1.A22)
LCD1_BKLT_EN: 02 (R12.1), 01 (J1.B107)
LDC0_VDD_EN: 05 (U7.23), 01 (J1.B133)
LDC1_VDD_EN: 05 (U7.42), 01 (J1.B116)
MCLK_OUT: 08 (J9.4), 01 (J1.B6)
MDI0+: 06 (J4.1), 01 (J1.A30)
MDI0-: 06 (J4.2), 01 (J1.A29)
MDI1+: 06 (J4.3), 01 (J1.A27)
MDI1-: 06 (J4.6), 01 (J1.A26)
MDI2+: 06 (J4.7), 01 (J1.A24)
MDI2-: 06 (J4.8), 01 (J1.A23)
MDI3+: 06 (J4.9), 01 (J1.A20)
MDI3-: 06 (J4.10), 01 (J1.A19)
MIC1_IN: 09 (5 pins), 01 (R1.2)
MIC2_IN: 09 (R66.2), 06 (AV1.5 ED4.1 R41.1 R42.2), 01 (R2.2)
MIPI_RX0_CLKN: 08 (J9.8), 01 (J1.B9)
MIPI_RX0_CLKP: 08 (J9.7), 01 (J1.B8)
MIPI_RX0_D0N: 08 (J9.14), 01 (J1.B12)
MIPI_RX0_D0P: 08 (J9.13), 01 (J1.B11)
MIPI_RX0_D1N: 08 (J9.11), 01 (J1.B15)
MIPI_RX0_D1P: 08 (J9.10), 01 (J1.B14)
MIPI_TX0_CLKN: 08 (J10.11), 01 (J1.B135)
MIPI_TX0_CLKP: 08 (J10.10), 01 (J1.B134)
MIPI_TX0_D0N: 08 (J10.8), 01 (J1.B126)
MIPI_TX0_D0P: 08 (J10.7), 01 (J1.B125)
MIPI_TX0_D1N: 08 (J10.14), 01 (J1.B129)
MIPI_TX0_D1P: 08 (J10.13), 01 (J1.B128)
NPU_UART2_RX: 08 (J19.2), 01 (J1.A141)
NPU_UART2_TX: 08 (J19.1), 01 (J1.A140)
PCIE_CLKREQNB: 03 (U2.52), 01 (J1.B76)
PCIE_PERST#_3.3V: 03 (U2.50), 01 (J1.A75)
PCIE_PWR: 03 (R21.2 U3.6), 01 (J1.A119)
PCIE_REF_CLKN: 03 (U2.53), 01 (J1.A84)
PCIE_REF_CLKP: 03 (U2.55), 01 (J1.A83)
PCIE_RX0N: 03 (U2.41), 01 (J1.A87)
PCIE_RX0P: 03 (U2.43), 01 (J1.A86)
PCIE_RX1N: 03 (U2.29), 01 (J1.B88)
PCIE_RX1P: 03 (U2.31), 01 (J1.B87)
PCIE_RX2N: 03 (U2.17), 01 (J1.B79)
PCIE_RX2P: 03 (U2.19), 01 (J1.B78)
PCIE_RX3N: 03 (U2.5), 01 (J1.B33)
PCIE_RX3P: 03 (U2.7), 01 (J1.B32)
PCIE_TX0N: 03 (C19.1), 01 (J1.A90)
PCIE_TX0P: 03 (C20.1), 01 (J1.A89)
PCIE_TX1N: 03 (C17.1), 01 (J1.B91)
PCIE_TX1P: 03 (C18.1), 01 (J1.B90)
PCIE_TX2N: 03 (C15.1), 01 (J1.B82)
PCIE_TX2P: 03 (C16.1), 01 (J1.B81)
PCIE_TX3N: 03 (C13.1), 01 (J1.B30)
PCIE_TX3P: 03 (C14.1), 01 (J1.B29)
PORT_HPD: 04 (J3.19 U4.5 U4.6), 01 (J1.A104)
PWM0: 08 (CON1.11 ED26.1), 02 (R16.1 R19.1), 01 (J1.B122)
PWM1: 08 (CON1.13 ED27.1), 01 (J1.B141)
PWM3: 10 (D2.1 R81.1), 01 (J1.A113)
RTC_CLKO_WIFI: 11 (R97.1 U21.7), 05 (U7.50)
RTC_INT: 11 (U21.3), 01 (J1.A6)
SDIO0_CLK/GPIO2_D1: 05 (U7.9), 01 (J1.B44)
SDIO0_CMD/GPIO2_D0: 05 (U7.11), 01 (J1.B43)
SDIO0_D0/SPI5_RXD: 05 (U7.13), 01 (J1.A45)
SDIO0_D1/SPI5_TXD: 05 (U7.15), 01 (J1.A46)
SDIO0_D2/SPI5_CLK: 05 (U7.17), 01 (J1.A44)
SDIO0_D3/SPI5_CSN: 05 (U7.19), 01 (J1.A43)
SDMMC0_CLK: 10 (R77.1), 01 (J1.A36)
SDMMC0_CMD: 10 (CN14.3 ED20.1), 01 (J1.A34)
SDMMC0_D0/UART2_RX: 10 (CN14.7 ED18.1), 01 (J1.A39)
SDMMC0_D1/UART2_TX: 10 (CN14.8 ED17.1), 01 (J1.A40)
SDMMC0_D2/JTAG_TCK: 10 (CN14.1 ED22.1), 01 (J1.A41)
SDMMC0_D3/JTAG_TMS: 10 (CN14.2 ED21.1), 01 (J1.A42)
SDMMC0_DET_L: 10 (CN14.9 ED16.1), 01 (J1.A35)
SLEEP#: 05 (U7.20), 01 (J1.B149)
SLEEP_L: 11 (LED1.2), 01 (J1.B153)
SMB_ALERT_1V8#: 05 (U7.21), 01 (J1.A1)
SPDIF_TX: 08 (CON1.15), 01 (J1.B123)
SPI1_CLK: 08 (U90052.B3), 01 (J1.A56)
SPI1_CS0: 08 (U90052.A3), 01 (J1.A54)
SPI1_RXD: 08 (U90052.D3), 01 (J1.A57)
SPI1_TXD: 08 (U90052.C3), 01 (J1.A58)
TYPEC0_DM: 07 (FB2.1), 01 (J1.B69)
TYPEC0_DP: 07 (FB2.4), 01 (J1.B68)
TYPEC0_ID: 07 (R54.1), 01 (J1.A64)
TYPEC0_RX1N: 07 (U8.1 U8.10 USB1.5), 01 (J1.B66)
TYPEC0_RX1P: 07 (U8.2 U8.9 USB1.6), 01 (J1.B65)
TYPEC0_TX1N: 07 (C44.1), 01 (J1.B63)
TYPEC0_TX1P: 07 (C43.1), 01 (J1.B62)
TYPEC0_U2VBUSDET: 07 (C48.1 R52.2 R53.1), 01 (J1.B37)
TYPEC_D: 12 (C115.1 R121.2 R122.1), 01 (J1.A125)
UART0_CTS: 05 (U7.34), 01 (J1.A132)
UART0_RTS: 05 (U7.36), 01 (J1.A131)
UART0_RXD: 05 (U7.22), 01 (J1.A130)
UART0_TXD: 05 (U7.32), 01 (J1.A129)
UART2_RX: 08 (U90055.D3), 01 (J1.A135)
UART2_TX: 08 (U90055.C3), 01 (J1.A134)
USB0_EN_OC#: 07 (U9.4), 01 (J1.A62)
USB1_EN_OC#: 07 (U10.4), 01 (J1.A67)
VIN_PWR_BAD#: 04 (Q7.2 R32.2), 01 (J1.B150)